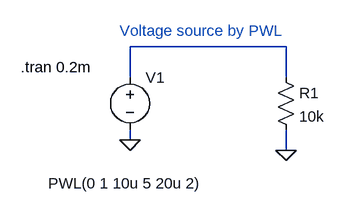
[diagram p0: schematic LTspice 02-6 PWL data.asc]
LTspice 02-6 PWL data.asc, the LTspice schematic file:
Version 4
SHEET 1 1076 680
WIRE 320 64 80 64
WIRE 80 112 80 64
WIRE 320 112 320 64
WIRE 80 208 80 192
WIRE 320 224 320 192
FLAG 80 208 0
FLAG 320 224 0
SYMBOL voltage 80 96 R0
WINDOW 3 -126 179 Left 2
WINDOW 123 0 0 Left 2
WINDOW 39 0 0 Left 2
SYMATTR Value PWL(0 1 10u 5 20u 2)
SYMATTR InstName V1
SYMBOL res 304 96 R0
SYMATTR InstName R1
SYMATTR Value 10k
TEXT -88 96 Left 2 !.tran 0.2m
TEXT 64 40 Left 2 ;Voltage source by PWL

The netlist it stands for:
* LTspice 02-6 PWL data.asc
V1 N001 0 PWL(0 1 10u 5 20u 2)
R1 N001 0 10k
.tran 0.2m
* Voltage source by PWL
.backanno
.end